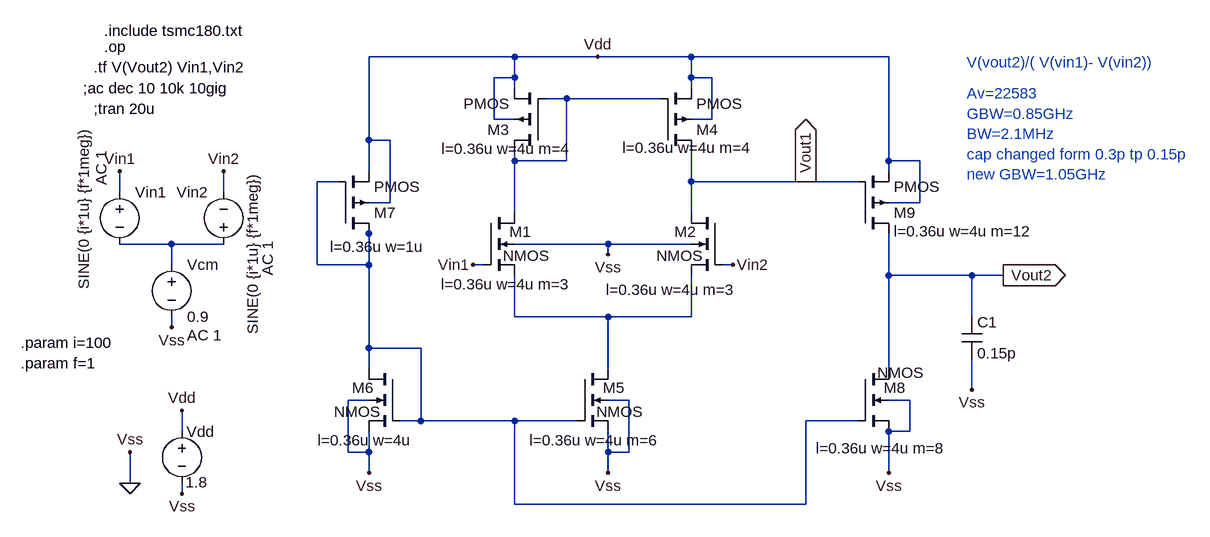
[diagram p0: schematic Two stage OP_AMP_11.asc]
Two stage OP_AMP_11.asc, the LTspice schematic file:
Version 4
SHEET 1 2080 820
WIRE 976 -16 752 -16
WIRE 1104 -16 976 -16
WIRE 1248 -16 1104 -16
WIRE 1552 -16 1248 -16
WIRE 976 16 976 -16
WIRE 976 16 944 16
WIRE 1248 16 1248 -16
WIRE 1280 16 1248 16
WIRE 976 32 976 16
WIRE 1248 32 1248 16
WIRE 1056 48 1024 48
WIRE 1200 48 1056 48
WIRE 944 80 944 16
WIRE 976 80 944 80
WIRE 1280 80 1280 16
WIRE 1280 80 1248 80
WIRE 752 112 752 -16
WIRE 784 112 752 112
WIRE 976 144 976 128
WIRE 1056 144 1056 48
WIRE 1056 144 976 144
WIRE 1552 144 1552 -16
WIRE 1600 144 1552 144
WIRE 752 160 752 112
WIRE 1552 160 1552 144
WIRE 704 176 672 176
WIRE 1248 176 1248 128
WIRE 1424 176 1248 176
WIRE 1504 176 1424 176
WIRE 368 192 368 160
WIRE 528 192 528 160
WIRE 784 208 784 112
WIRE 784 208 752 208
WIRE 1600 208 1600 144
WIRE 1600 208 1552 208
WIRE 976 224 976 144
WIRE 1248 224 1248 176
WIRE 752 256 752 240
WIRE 448 272 368 272
WIRE 528 272 448 272
WIRE 1120 272 976 272
WIRE 1248 272 1120 272
WIRE 1120 288 1120 272
WIRE 448 304 448 272
WIRE 672 304 672 176
WIRE 752 304 752 256
WIRE 752 304 672 304
WIRE 928 304 912 304
WIRE 1312 304 1296 304
WIRE 1552 320 1552 256
WIRE 1680 320 1552 320
WIRE 1728 320 1680 320
WIRE 976 384 976 320
WIRE 1120 384 976 384
WIRE 1248 384 1248 320
WIRE 1248 384 1120 384
WIRE 1680 384 1680 320
WIRE 448 400 448 384
WIRE 752 432 752 304
WIRE 832 432 752 432
WIRE 752 464 752 432
WIRE 1120 464 1120 384
WIRE 1552 464 1552 320
WIRE 1680 496 1680 448
WIRE 752 512 720 512
WIRE 1152 512 1120 512
WIRE 1584 512 1552 512
WIRE 832 544 832 432
WIRE 832 544 800 544
WIRE 976 544 832 544
WIRE 1072 544 976 544
WIRE 1504 544 1424 544
WIRE 464 560 464 528
WIRE 1584 560 1584 512
WIRE 1584 560 1552 560
WIRE 720 592 720 512
WIRE 752 592 752 560
WIRE 752 592 720 592
WIRE 1120 592 1120 560
WIRE 1152 592 1152 512
WIRE 1152 592 1120 592
WIRE 752 624 752 592
WIRE 1120 624 1120 592
WIRE 1552 624 1552 560
WIRE 384 640 384 592
WIRE 464 656 464 640
WIRE 976 672 976 544
WIRE 1424 672 1424 544
WIRE 1424 672 976 672
FLAG 384 640 0
FLAG 384 592 Vss
FLAG 464 656 Vss
FLAG 448 400 Vss
FLAG 464 528 Vdd
FLAG 912 304 Vin1
FLAG 1104 -16 Vdd
FLAG 1312 304 Vin2
FLAG 1120 288 Vss
FLAG 368 160 Vin1
FLAG 528 160 Vin2
FLAG 1120 624 Vss
FLAG 752 624 Vss
FLAG 1552 624 Vss
FLAG 1728 320 Vout2
IOPIN 1728 320 Out
FLAG 1680 496 Vss
FLAG 1424 176 Vout1
IOPIN 1424 176 Out
SYMBOL nmos4 928 224 R0
WINDOW 0 40 29 Left 2
WINDOW 3 30 66 Left 2
WINDOW 123 135 110 Right 2
SYMATTR InstName M1
SYMATTR Value2 l=0.36u w=4u m=3
SYMBOL voltage 464 544 R0
WINDOW 123 0 0 Left 0
WINDOW 39 0 0 Left 0
WINDOW 0 7 17 Left 2
WINDOW 3 6 94 Left 2
SYMATTR InstName Vdd
SYMATTR Value 1.8
SYMBOL nmos4 1296 224 M0
WINDOW 0 40 29 Left 2
WINDOW 3 30 66 Left 2
WINDOW 123 -21 118 Left 2
SYMATTR InstName M2
SYMATTR Value2 l=0.36u w=4u m=3
SYMBOL voltage 448 288 R0
WINDOW 123 24 124 Left 2
WINDOW 39 0 0 Left 0
SYMATTR Value2 AC 1
SYMATTR InstName Vcm
SYMATTR Value 0.9
SYMBOL voltage 368 176 R0
WINDOW 3 -55 -84 VRight 2
WINDOW 123 -28 -48 VRight 2
WINDOW 39 0 0 Left 0
SYMATTR Value SINE(0 {i*1u} {f*1meg})
SYMATTR Value2 AC 1
SYMATTR InstName Vin1
SYMBOL voltage 528 288 R180
WINDOW 0 24 96 Left 2
WINDOW 3 -45 -123 VRight 2
WINDOW 123 -68 -33 VRight 2
WINDOW 39 0 0 Left 0
SYMATTR InstName Vin2
SYMATTR Value SINE(0 {i*1u} {f*1meg})
SYMATTR Value2 AC 1
SYMBOL pmos4 1024 128 R180
WINDOW 123 -40 3 Left 2
SYMATTR Value2 l=0.36u w=4u m=4
SYMATTR InstName M3
SYMBOL pmos4 1200 128 M180
WINDOW 123 -58 4 Left 2
SYMATTR Value2 l=0.36u w=4u m=4
SYMATTR InstName M4
SYMBOL nmos4 1072 464 R0
WINDOW 0 40 29 Left 2
WINDOW 3 30 66 Left 2
WINDOW 123 127 110 Right 2
SYMATTR InstName M5
SYMATTR Value2 l=0.36u w=4u m=6
SYMBOL nmos4 800 464 M0
WINDOW 0 40 29 Left 2
WINDOW 3 30 66 Left 2
WINDOW 123 127 110 Right 2
SYMATTR InstName M6
SYMATTR Value2 l=0.36u w=4u
SYMBOL pmos4 704 256 M180
WINDOW 123 -12 -20 Left 2
SYMATTR Value2 l=0.36u w=1u
SYMATTR InstName M7
SYMBOL nmos4 1504 464 R0
WINDOW 0 40 29 Left 2
WINDOW 3 30 6 Left 2
WINDOW 123 136 122 Right 2
SYMATTR InstName M8
SYMATTR Value2 l=0.36u w=4u m=8
SYMBOL cap 1664 384 R0
SYMATTR InstName C1
SYMATTR Value 0.15p
SYMBOL pmos4 1504 256 M180
WINDOW 123 56 4 Left 2
SYMATTR Value2 l=0.36u w=4u m=12
SYMATTR InstName M9
TEXT 344 -56 Left 2 !.include tsmc180.txt
TEXT 344 -32 Left 2 !.op
TEXT 328 0 Left 2 !.tf V(Vout2) Vin1,Vin2
TEXT 312 32 Left 2 !;ac dec 10 10k 10gig
TEXT 328 64 Left 2 !;tran 20u
TEXT 216 424 Left 2 !.param i=100\n.param f=1
TEXT 1672 -8 Left 2 ;V(vout2)/( V(vin1)- V(vin2))
TEXT 1672 40 Left 2 ;Av=22583\nGBW=0.85GHz\nBW=2.1MHz\ncap changed form 0.3p tp 0.15p\nnew GBW=1.05GHz

The netlist it stands for:
* Two stage OP_AMP_11.asc
M1 N001 Vin1 N004 0 NMOS l=0.36u w=4u m=3
Vdd Vdd 0 1.8
M2 Vout1 Vin2 N004 0 NMOS l=0.36u w=4u m=3
Vcm N003 0 0.9 AC 1
Vin1 Vin1 N003 SINE(0 {i*1u} {f*1meg}) AC 1
Vin2 N003 Vin2 SINE(0 {i*1u} {f*1meg}) AC 1
M3 N001 N001 Vdd Vdd PMOS l=0.36u w=4u m=4
M4 Vout1 N001 Vdd Vdd PMOS l=0.36u w=4u m=4
M5 N004 N002 0 0 NMOS l=0.36u w=4u m=6
M6 N002 N002 0 0 NMOS l=0.36u w=4u
M7 N002 N002 Vdd Vdd PMOS l=0.36u w=1u
M8 Vout2 N002 0 0 NMOS l=0.36u w=4u m=8
C1 Vout2 0 0.15p
M9 Vout2 Vout1 Vdd Vdd PMOS l=0.36u w=4u m=12
.model NMOS NMOS
.model PMOS PMOS
.lib standard.mos
.include tsmc180.txt
.op
.tf V(Vout2) Vin1,Vin2
;ac dec 10 10k 10gig
;tran 20u
.param i=100
.param f=1
* V(vout2)/( V(vin1)- V(vin2))
* Av=22583
* GBW=0.85GHz
* BW=2.1MHz
* cap changed form 0.3p tp 0.15p
* new GBW=1.05GHz
.backanno
.end